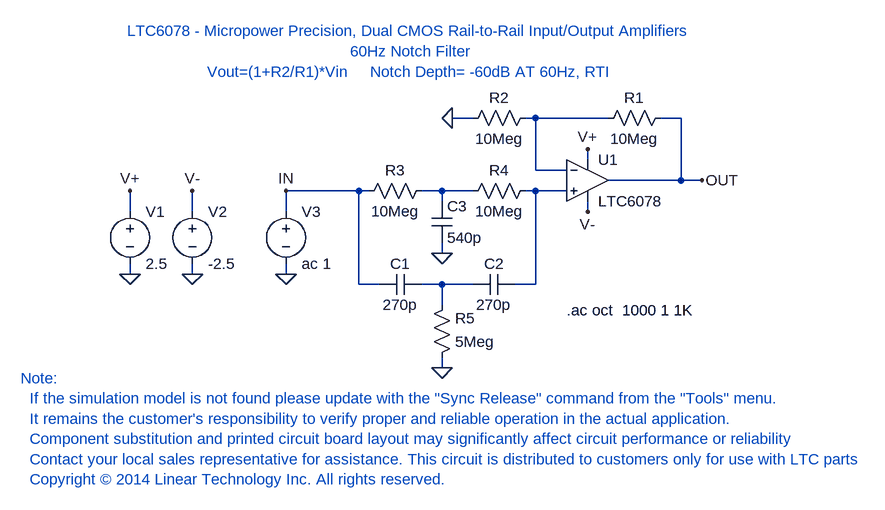
[diagram p0: schematic LTC6078_TA15.asc]
LTC6078_TA15.asc, the LTspice schematic file:
Version 4
SHEET 1 1160 936
WIRE 48 320 16 320
WIRE 144 320 128 320
WIRE 256 320 144 320
WIRE 368 320 336 320
WIRE 224 384 224 368
WIRE 144 400 144 320
WIRE 192 400 144 400
WIRE 368 416 368 320
WIRE 368 416 256 416
WIRE 400 416 368 416
WIRE -128 432 -240 432
WIRE -112 432 -128 432
WIRE 0 432 -32 432
WIRE 48 432 0 432
WIRE 144 432 128 432
WIRE 192 432 144 432
WIRE 0 448 0 432
WIRE -480 464 -480 432
WIRE -384 464 -384 432
WIRE -240 464 -240 432
WIRE 224 464 224 448
WIRE 0 528 0 512
WIRE -480 560 -480 544
WIRE -384 560 -384 544
WIRE -240 560 -240 544
WIRE -128 576 -128 432
WIRE -96 576 -128 576
WIRE 0 576 -32 576
WIRE 48 576 0 576
WIRE 144 576 144 432
WIRE 144 576 112 576
WIRE 0 608 0 576
WIRE 0 704 0 688
FLAG -480 560 0
FLAG -480 432 V+
FLAG -384 560 0
FLAG -384 432 V-
FLAG 224 368 V+
FLAG 224 464 V-
FLAG -240 560 0
FLAG 16 320 0
FLAG 0 704 0
FLAG 0 528 0
FLAG 400 416 OUT
FLAG -240 432 IN
SYMBOL voltage -480 448 R0
SYMATTR InstName V1
SYMATTR Value 2.5
SYMBOL voltage -384 448 R0
SYMATTR InstName V2
SYMATTR Value -2.5
SYMBOL LTC6078 224 416 R0
SYMATTR InstName U1
SYMATTR Description Micropower Precision, CMOS Rail-to-Rail Amplifier
SYMBOL voltage -240 448 R0
SYMATTR InstName V3
SYMATTR Value ac 1
SYMBOL res 352 304 R90
WINDOW 0 0 56 VBottom 2
WINDOW 3 32 56 VTop 2
SYMATTR InstName R1
SYMATTR Value 10Meg
SYMBOL res 144 304 R90
WINDOW 0 0 56 VBottom 2
WINDOW 3 32 56 VTop 2
SYMATTR InstName R2
SYMATTR Value 10Meg
SYMBOL res -16 416 R90
WINDOW 0 0 56 VBottom 2
WINDOW 3 32 56 VTop 2
SYMATTR InstName R3
SYMATTR Value 10Meg
SYMBOL res 144 416 R90
WINDOW 0 0 56 VBottom 2
WINDOW 3 32 56 VTop 2
SYMATTR InstName R4
SYMATTR Value 10Meg
SYMBOL res -16 704 M180
WINDOW 0 36 76 Left 2
WINDOW 3 36 40 Left 2
SYMATTR InstName R5
SYMATTR Value 5Meg
SYMBOL cap -32 560 R90
WINDOW 0 0 32 VBottom 2
WINDOW 3 32 32 VTop 2
SYMATTR InstName C1
SYMATTR Value 270p
SYMBOL cap 112 560 R90
WINDOW 0 0 32 VBottom 2
WINDOW 3 32 32 VTop 2
SYMATTR InstName C2
SYMATTR Value 270p
SYMBOL cap -16 448 R0
SYMATTR InstName C3
SYMATTR Value 540p
TEXT 192 616 Left 2 !.ac oct  1000 1 1K
TEXT -48 264 Bottom 2 ;LTC6078 - Micropower Precision, Dual CMOS Rail-to-Rail Input/Output Amplifiers\n60Hz Notch Filter\nVout=(1+R2/R1)*Vin     Notch Depth= -60dB AT 60Hz, RTI
TEXT -648 720 Left 2 ;Note:\n  If the simulation model is not found please update with the "Sync Release" command from the "Tools" menu.\n  It remains the customer's responsibility to verify proper and reliable operation in the actual application.\n  Component substitution and printed circuit board layout may significantly affect circuit performance or reliability\n  Contact your local sales representative for assistance. This circuit is distributed to customers only for use with LTC parts\n  Copyright © 2014 Linear Technology Inc. All rights reserved.

The netlist it stands for:
* LTC6078_TA15.asc
V1 V+ 0 2.5
V2 V- 0 -2.5
XU1 N003 N001 V+ V- OUT LTC6078  ; pins IN+ IN- VCC VEE OUT
V3 IN 0 ac 1
R1 OUT N001 10Meg
R2 N001 0 10Meg
R3 N002 IN 10Meg
R4 N003 N002 10Meg
R5 0 N004 5Meg
C1 N004 IN 270p
C2 N003 N004 270p
C3 N002 0 540p
.ac oct  1000 1 1K
* LTC6078 - Micropower Precision, Dual CMOS Rail-to-Rail Input/Output Amplifiers
* 60Hz Notch Filter
* Vout=(1+R2/R1)*Vin     Notch Depth= -60dB AT 60Hz, RTI
* Note:
*   If the simulation model is not found please update with the "Sync Release" command from the "Tools" menu.
*   It remains the customer's responsibility to verify proper and reliable operation in the actual application.
*   Component substitution and printed circuit board layout may significantly affect circuit performance or reliability
*   Contact your local sales representative for assistance. This circuit is distributed to customers only for use with LTC parts
*   Copyright © 2014 Linear Technology Inc. All rights reserved.
.lib LTC5.lib
.backanno
.end